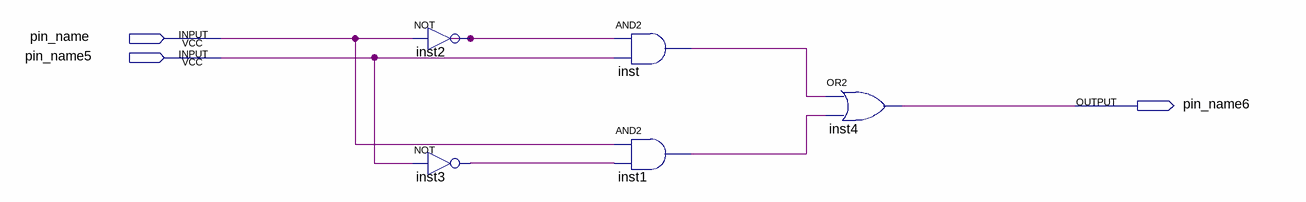
[diagram p0: schematic sheet]
// Quartus schematic my_xor_logic.bdf as structural Verilog: 5 symbols, 3 pins
module my_xor_logic (
  input  pin_name,
  input  pin_name5,
  output pin_name6
);

  wire inst1_out, inst2_out, inst3_out, inst_out;

  not inst2 (inst2_out, pin_name);
  not inst3 (inst3_out, pin_name5);
  and inst (inst_out, inst2_out, pin_name5);
  and inst1 (inst1_out, pin_name, inst3_out);
  or inst4 (pin_name6, inst_out, inst1_out);
endmodule
